# Altium schematic sheet ANL_P54_Buffer.SchDoc
size A4; SheetNumber: 19
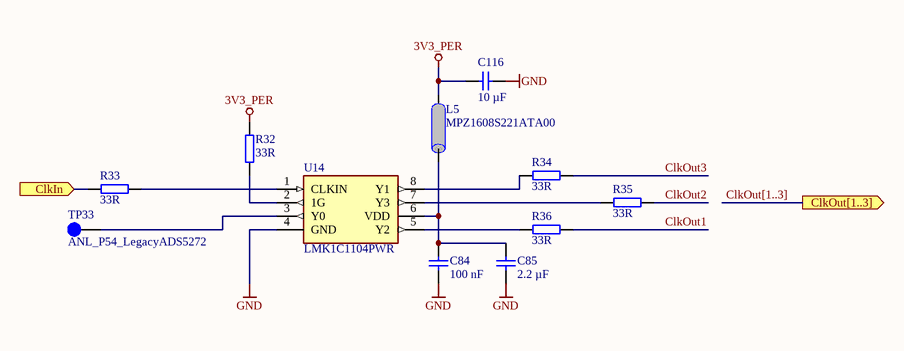
[diagram p0: ANL_P54_Buffer.SchDoc]

## Parts
C84  100 nF  [C_0603_TE]
C85  2.2 µF  [C_0603_TE]
C116  10 µF  [C_0603_TE]
L5  MPZ1608S221ATA00  [RES 0603_1608]
R32  33R  [R_0603_TE]
R33  33R  [R_0603_TE]
R34  33R  [R_0603_TE]
R35  33R  [R_0603_TE]
R36  33R  [R_0603_TE]
TP33  ANL_P54_LegacyADS5272  [TP_1mm]  (no BOM)
U14  LMK1C1104PWR  [TSSOP-8]

## Ports
ClkIn (in), ClkOut[1..3] (out)

## Nets
3V3_PER: C116.2 L5.1 R32.1
GND: C84.1 C85.1 C116.1 U14.4(GND)
ClkIn: R33.2 ; port ClkIn
ClkOut1: R36.1
ClkOut2: R35.1
ClkOut3: R34.1
NetC84_2: C84.2 C85.2 L5.2 U14.6(VDD)
NetR32_2: R32.2 U14.2(1G)
NetR33_1: R33.1 U14.1(CLKIN)
NetR34_2: R34.2 U14.8(Y1)
NetR35_2: R35.2 U14.7(Y3)
NetR36_2: R36.2 U14.5(Y2)
NetTP33_1: TP33.1 U14.3(Y0)

## Buses and harness runs
bus ClkOut[1..3] = port ClkOut[1..3]

## Notes on the sheet
- Title
- Revision:
- Design Engineer:
- Date:
- Project:
- Sheet
- of

## Library data of the parts
C84 = UZgen_C_0603_100nF_50V_X7R: Generic capacitor; Manufacturer: UZgen; Voltage: 50V; Tolerance: 10 %; Created from: AGeiger; Manufacturer Part Number: UZgen_C_0603_100nF_50V_X7R; PartID: 1; Created On: 02/07/2024 14:42:23; Value: 100 nF; Device Package: 0603; Technology: X7R; Mounting Type: SMD; Last Updated: 08/08/2024 15:01:15
C85 = UZgen_C_0603_2.2uF_50V_X7R: Generic capacitor; Manufacturer: UZgen; Voltage: 50V; Tolerance: 10 %; Created from: UZgenTool; Manufacturer Part Number: UZgen_C_0603_2.2uF_50V_X7R; PartID: 4317; Created On: 02/08/2024 11:18:10; Value: 2.2 µF; Device Package: 0603; Technology: X7R; Mounting Type: SMD; Last Updated: 02/08/2024 11:18:10
C116 = UZgen_C_0603_10uF_6.3V_X7R: Generic capacitor; Manufacturer: UZgen; Voltage: 6.3V; Tolerance: 10 %; Created from: UZgenTool; Manufacturer Part Number: UZgen_C_0603_10uF_6.3V_X7R; PartID: 3631; Created On: 02/08/2024 11:17:55; Value: 10 µF; Device Package: 0603; Technology: X7R; Mounting Type: SMD; Last Updated: 02/08/2024 11:17:55
L5 = MPZ1608S221ATA00: Ferritperle, 0603, 220 ohm, 2.2 A, Baureihe MPZ, 0.05 ohm, ± 25%; Manufacturer: TDK; Type: Ferrite; DC current: 2.2 A; Value: 220 Ohm; Created from: MGremer; Manufacturer Part Number: MPZ1608S221ATA00; PartID: 3; Created On: 08/06/2021 11:33:39; ComponentLink1Description: Datasheet; ComponentLink1URL: http://www.farnell.com/datasheets/2291439.pdf; Component Type: Ferritperle; Device Package: 0603; Last Updated: 12/07/2024 17:26:54; Mounting Type: SMD; Operating Temperature: -55 - 125 °C; Series: MPZ; Supplier 1: Farnell; Supplier Part Number 1: 1301677RL; Live Cycle Status: 1; LCSC Part Number: C76815; Stock number: not stored
R32-R36 = UZgen_R_0603_33R: Generic resistor; Manufacturer: UZgen; Tolerance: 1 %; Created from: UZgenTool; Manufacturer Part Number: UZgen_R_0603_33R; PartID: 185; Created On: 02/07/2024 17:29:48; Value: 33R; Device Package: 0603; Mounting Type: SMD; Last Updated: 02/07/2024 17:29:48
TP33 = NULL: Testpoint 1mm; Manufacturer Part Number: NULL; Created from: AGeiger; Created: 2018_06_25_AGeiger; Value: ANL_P54_LegacyADS5272; PartID: 9; Created On: 20/09/2022 13:14:57; Component Type: Testpoint; Last Updated: 20/09/2022 13:15:39; Manufacturer: NULL; Supplier 1: NULL; Supplier Part Number 1: NULL; Type: Testpoint; Live Cycle Status: 1
U14 = LMK1C1104PWR: 250MHz TSSOP-8 Clock Buffers, Drivers ROHS; Manufacturer: Texas Instruments; Created from: FRosner; Manufacturer Part Number: LMK1C1104PWR; PartID: 6; Created On: 18/06/2025 09:32:31; ComponentLink1Description: Datasheet; ComponentLink1URL: https://www.ti.com/cn/lit/ds/symlink/lmk1c1104.pdf?ts=1750149306598&ref_url=https%253A%252F%252Flist.szlcsc.com%252F; Component Type: Clock Buffer; Device Package: TSSOP-8; Last Updated: 18/06/2025 09:32:31; Mounting Type: SMD; Operating Temperature: -40 to +125°C; Supplier 1: LCSC; Supplier Part Number 1: C1855734; Value: 250MHz; LCSC Part Number: C1855734